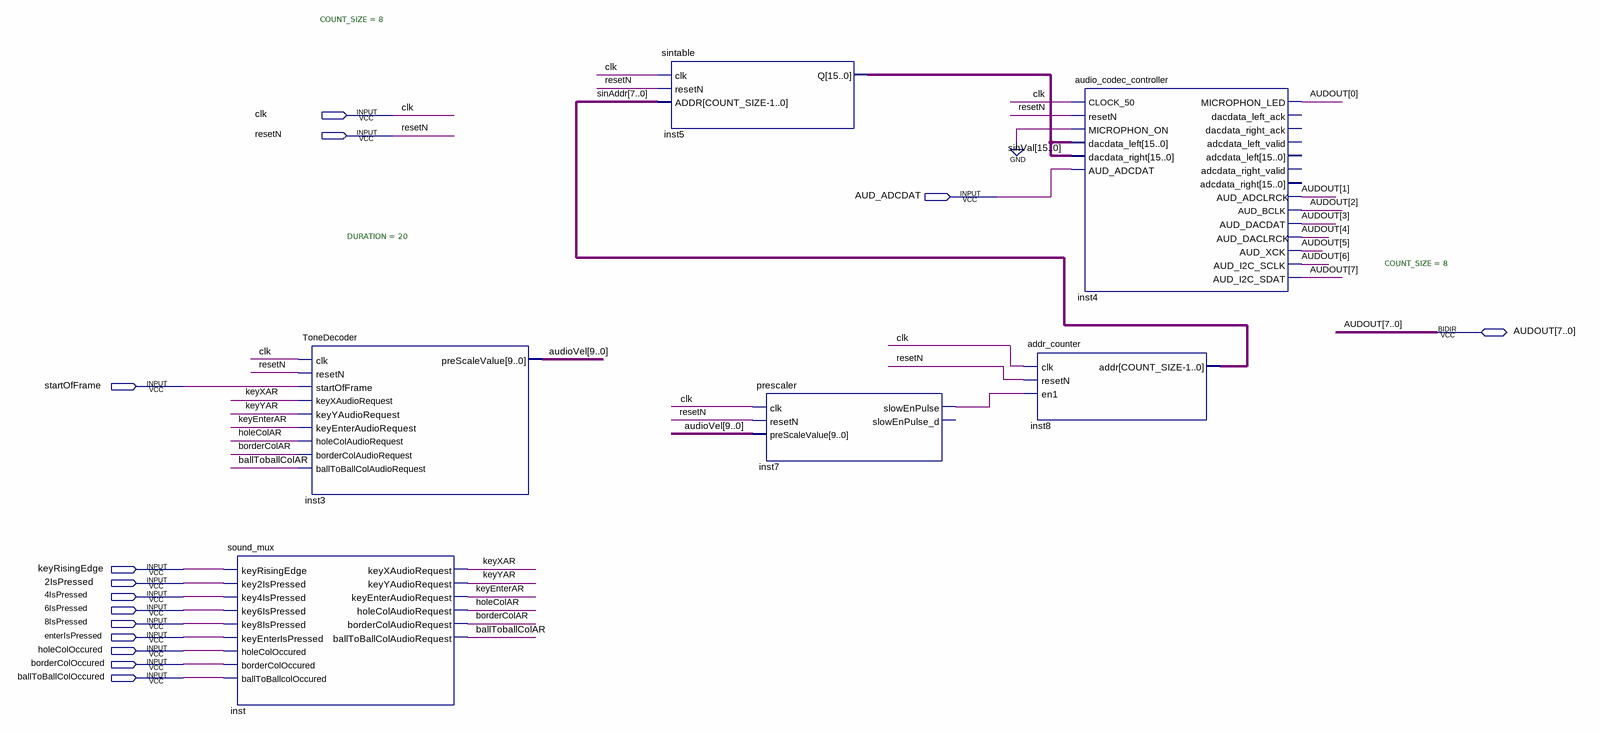
[diagram p0: schematic sheet]
// Quartus schematic TOP_AUDIO.bdf as structural Verilog: 6 symbols, 14 pins
module TOP_AUDIO (
  input  clk,
  input  resetN,
  input  AUD_ADCDAT,
  input  startOfFrame,
  input  keyRisingEdge,
  input  \2IsPressed ,
  input  \4IsPressed ,
  input  \6IsPressed ,
  input  \8IsPressed ,
  input  enterIsPressed,
  input  holeColOccured,
  input  borderColOccured,
  input  ballToBallColOccured,
  inout  [7:0] AUDOUT
);

  wire ballToballColAR, borderColAR, holeColAR, inst7_slowenpulse, keyEnterAR, keyXAR, keyYAR;
  wire [7:0] sinAddr;
  wire [9:0] audioVel;
  wire [15:0] sinVal;

  sound_mux inst (
    .keyRisingEdge(keyRisingEdge), .key2IsPressed(\2IsPressed ), .key4IsPressed(\4IsPressed ),
    .key6IsPressed(\6IsPressed ), .key8IsPressed(\8IsPressed ), .keyEnterIsPressed(enterIsPressed),
    .holeColOccured(holeColOccured), .borderColOccured(borderColOccured),
    .ballToBallcolOccured(ballToBallColOccured), .keyXAudioRequest(keyXAR), .keyYAudioRequest(keyYAR),
    .keyEnterAudioRequest(keyEnterAR), .holeColAudioRequest(holeColAR), .borderColAudioRequest(borderColAR),
    .ballToBallColAudioRequest(ballToballColAR));
  ToneDecoder #(.DURATION(20)) inst3 (
    .clk(clk), .resetN(resetN), .startOfFrame(startOfFrame), .keyXAudioRequest(keyXAR),
    .keyYAudioRequest(keyYAR), .keyEnterAudioRequest(keyEnterAR), .holeColAudioRequest(holeColAR),
    .borderColAudioRequest(borderColAR), .ballToBallColAudioRequest(ballToballColAR), .preScaleValue(audioVel));
  sintable #(.COUNT_SIZE(8)) inst5 (.clk(clk), .resetN(resetN), .ADDR(sinAddr), .Q(sinVal));
  prescaler inst7 (
    .clk(clk), .resetN(resetN), .preScaleValue(audioVel), .slowEnPulse(inst7_slowenpulse));  // open: slowEnPulse_d
  audio_codec_controller inst4 (
    .CLOCK_50(clk), .resetN(resetN), .MICROPHON_ON(1'b0), .dacdata_left(sinVal), .dacdata_right(sinVal),
    .AUD_ADCDAT(AUD_ADCDAT), .MICROPHON_LED(AUDOUT[0]), .AUD_DACDAT(AUDOUT[3]), .AUD_XCK(AUDOUT[5]),
    .AUD_I2C_SCLK(AUDOUT[6]), .AUD_ADCLRCK(AUDOUT[1]), .AUD_BCLK(AUDOUT[2]), .AUD_DACLRCK(AUDOUT[4]),
    .AUD_I2C_SDAT(AUDOUT[7]));  // open: dacdata_left_ack, dacdata_right_ack, adcdata_left_valid, adcdata_left, adcdata_right_valid, adcdata_right
  addr_counter #(.COUNT_SIZE(8)) inst8 (.clk(clk), .resetN(resetN), .en1(inst7_slowenpulse), .addr(sinAddr));
endmodule
